# EasyEDA schematic Sheet_1.json
TITLE: Sheet_1; REV: 1.0; Date: 2024-08-10; Sheet: 1/1; Drawn By: k754a; Company: Your Company
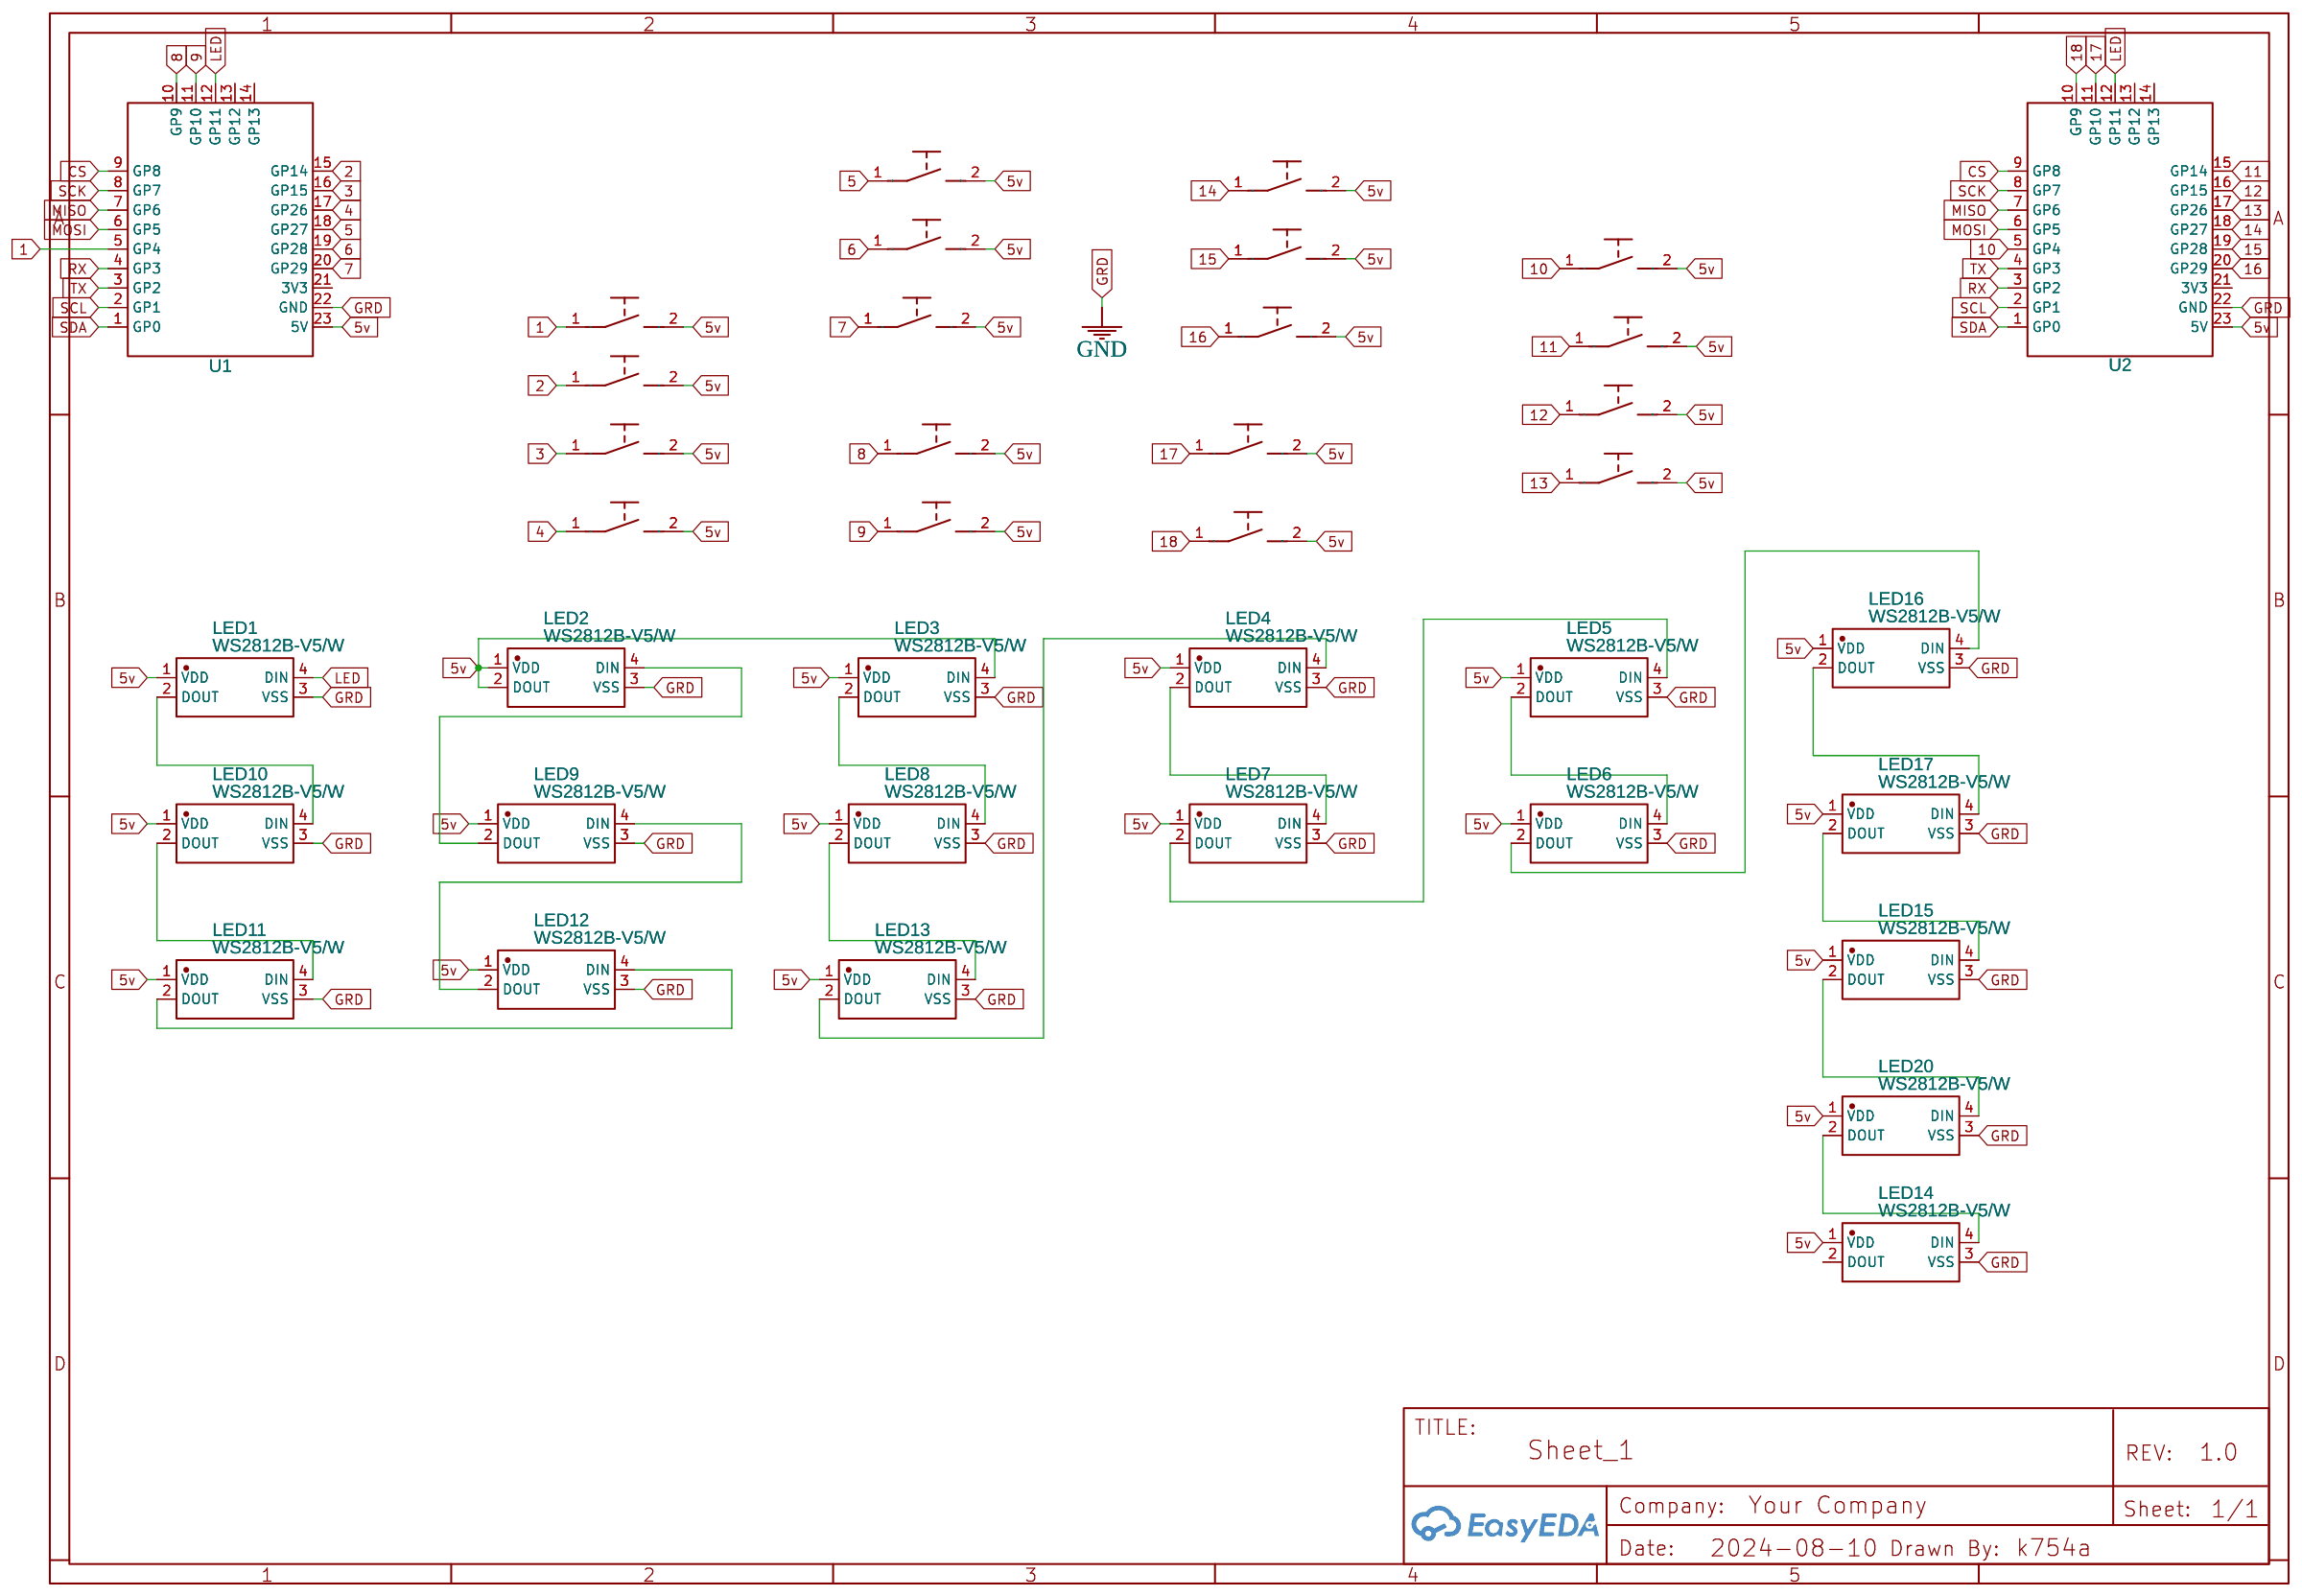
[diagram p0: schematic sheet]

## Parts
LED1  WS2812B-V5/W  [LED-SMD_4P-L5.0-W5.0-TL-1]
LED2  WS2812B-V5/W  [LED-SMD_4P-L5.0-W5.0-TL-1]
LED3  WS2812B-V5/W  [LED-SMD_4P-L5.0-W5.0-TL-1]
LED4  WS2812B-V5/W  [LED-SMD_4P-L5.0-W5.0-TL-1]
LED5  WS2812B-V5/W  [LED-SMD_4P-L5.0-W5.0-TL-1]
LED6  WS2812B-V5/W  [LED-SMD_4P-L5.0-W5.0-TL-1]
LED7  WS2812B-V5/W  [LED-SMD_4P-L5.0-W5.0-TL-1]
LED8  WS2812B-V5/W  [LED-SMD_4P-L5.0-W5.0-TL-1]
LED9  WS2812B-V5/W  [LED-SMD_4P-L5.0-W5.0-TL-1]
LED10  WS2812B-V5/W  [LED-SMD_4P-L5.0-W5.0-TL-1]
LED11  WS2812B-V5/W  [LED-SMD_4P-L5.0-W5.0-TL-1]
LED12  WS2812B-V5/W  [LED-SMD_4P-L5.0-W5.0-TL-1]
LED13  WS2812B-V5/W  [LED-SMD_4P-L5.0-W5.0-TL-1]
LED14  WS2812B-V5/W  [LED-SMD_4P-L5.0-W5.0-TL-1]
LED15  WS2812B-V5/W  [LED-SMD_4P-L5.0-W5.0-TL-1]
LED16  WS2812B-V5/W  [LED-SMD_4P-L5.0-W5.0-TL-1]
LED17  WS2812B-V5/W  [LED-SMD_4P-L5.0-W5.0-TL-1]
LED20  WS2812B-V5/W  [LED-SMD_4P-L5.0-W5.0-TL-1]
SW1  CPG151101S13  [KEY-TH_CPG1511F01S0X]
SW2  CPG151101S13  [KEY-TH_CPG1511F01S0X]
SW3  CPG151101S13  [KEY-TH_CPG1511F01S0X]
SW4  CPG151101S13  [KEY-TH_CPG1511F01S0X]
SW5  CPG151101S13  [KEY-TH_CPG1511F01S0X]
SW6  CPG151101S13  [KEY-TH_CPG1511F01S0X]
SW7  CPG151101S13  [KEY-TH_CPG1511F01S0X]
SW8  CPG151101S13  [KEY-TH_CPG1511F01S0X]
SW9  CPG151101S13  [KEY-TH_CPG1511F01S0X]
SW10  CPG151101S13  [KEY-TH_CPG1511F01S0X]
SW11  CPG151101S13  [KEY-TH_CPG1511F01S0X]
SW12  CPG151101S13  [KEY-TH_CPG1511F01S0X]
SW13  CPG151101S13  [KEY-TH_CPG1511F01S0X]
SW14  CPG151101S13  [KEY-TH_CPG1511F01S0X]
SW15  CPG151101S13  [KEY-TH_CPG1511F01S0X]
SW16  CPG151101S13  [KEY-TH_CPG1511F01S0X]
SW17  CPG151101S13  [KEY-TH_CPG1511F01S0X]
SW18  CPG151101S13  [KEY-TH_CPG1511F01S0X]
U1  RP2040-ZERO  [COMM-SMD_RP2040-ZERO]
U2  RP2040-ZERO  [COMM-SMD_RP2040-ZERO]

## Library data of the parts
LED1-LED17 LED20 = WS2812B-V5/W: Contributor: lcsc; Supplier: LCSC; Supplier Part: C2874885; Manufacturer: worldsemi; JLCPCB Part Class: Extended Part
SW1-SW18 = CPG151101S13: Contributor: LCSC; Supplier: LCSC; Supplier Part: C404353; Manufacturer: Kailh(凯华); JLCPCB Part Class: Extended Part
U1 U2 = RP2040-ZERO: Supplier: LCSC; Supplier Part: C5350143; Manufacturer: Waveshare(微雪电子); Manufacturer Part: RP2040-Zero; JLCPCB Part Class: Extended Part; Contributor: lcsc

## Nets
5v: LED1.1(VDD) LED2.1(VDD) LED2.2(DOUT) LED3.1(VDD) LED3.4(DIN) LED4.1(VDD) LED5.1(VDD) LED6.1(VDD) LED7.1(VDD) LED8.1(VDD) LED9.1(VDD) LED10.1(VDD) LED11.1(VDD) LED12.1(VDD) LED13.1(VDD) LED14.1(VDD) LED15.1(VDD) LED16.1(VDD) LED17.1(VDD) LED20.1(VDD) SW1.2 SW2.2 SW3.2 SW4.2 SW5.2 SW6.2 SW7.2 SW8.2 SW9.2 SW10.2 SW11.2 SW12.2 SW13.2 SW14.2 SW15.2 SW16.2 SW17.2 SW18.2 U1.23(5V) U2.23(5V)
GND: LED1.3(VSS) LED2.3(VSS) LED3.3(VSS) LED4.3(VSS) LED5.3(VSS) LED6.3(VSS) LED7.3(VSS) LED8.3(VSS) LED9.3(VSS) LED10.3(VSS) LED11.3(VSS) LED12.3(VSS) LED13.3(VSS) LED14.3(VSS) LED15.3(VSS) LED16.3(VSS) LED17.3(VSS) LED20.3(VSS) U1.22(GND) U2.22(GND)
1: SW1.1 U1.5(GP4)
2: SW2.1 U1.15(GP14)
3: SW3.1 U1.16(GP15)
4: SW4.1 U1.17(GP26)
5: SW5.1 U1.18(GP27)
6: SW6.1 U1.19(GP28)
7: SW7.1 U1.20(GP29)
8: SW8.1 U1.10(GP9)
9: SW9.1 U1.11(GP10)
10: SW18.1 U2.5(GP4)
11: SW17.1 U2.15(GP14)
12: SW16.1 U2.16(GP15)
13: SW10.1 U2.17(GP26)
14: SW14.1 U2.18(GP27)
15: SW13.1 U2.19(GP28)
16: SW12.1 U2.20(GP29)
17: SW11.1 U2.11(GP10)
18: SW15.1 U2.10(GP9)
CS: U1.9(GP8) U2.9(GP8)
LED: LED1.4(DIN) U1.12(GP11) U2.12(GP11)
MISO: U1.7(GP6) U2.7(GP6)
MOSI: U1.6(GP5) U2.6(GP5)
RX: U1.4(GP3) U2.3(GP2)
SCK: U1.8(GP7) U2.8(GP7)
SCL: U1.2(GP1) U2.2(GP1)
SDA: U1.1(GP0) U2.1(GP0)
TX: U1.3(GP2) U2.4(GP3)
Net-(LED1-2): LED1.2(DOUT) LED10.4(DIN)
Net-(LED2-4): LED2.4(DIN) LED9.2(DOUT)
Net-(LED3-2): LED3.2(DOUT) LED8.4(DIN)
Net-(LED4-2): LED4.2(DOUT) LED7.4(DIN)
Net-(LED4-4): LED4.4(DIN) LED13.2(DOUT)
Net-(LED5-2): LED5.2(DOUT) LED6.4(DIN)
Net-(LED5-4): LED5.4(DIN) LED7.2(DOUT)
Net-(LED6-2): LED6.2(DOUT) LED16.4(DIN)
Net-(LED8-2): LED8.2(DOUT) LED13.4(DIN)
Net-(LED9-4): LED9.4(DIN) LED12.2(DOUT)
Net-(LED10-2): LED10.2(DOUT) LED11.4(DIN)
Net-(LED11-2): LED11.2(DOUT) LED12.4(DIN)
Net-(LED14-4): LED14.4(DIN) LED20.2(DOUT)
Net-(LED15-2): LED15.2(DOUT) LED20.4(DIN)
Net-(LED15-4): LED15.4(DIN) LED17.2(DOUT)
Net-(LED16-2): LED16.2(DOUT) LED17.4(DIN)

Not connected (* = marked no-connect by the designer): LED14 2(DOUT); U1 13(GP12) 14(GP13) 21(3V3); U2 13(GP12) 14(GP13) 21(3V3)
